# EAGLE schematic LibraryTest (EAGLE 9.2.0)
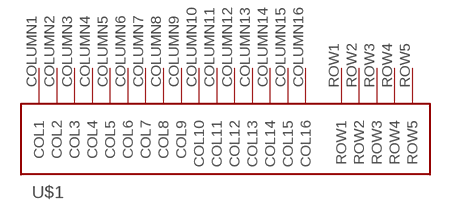
[diagram p0: schematic, sheet 1]

## Parts
U$1  SILICONEKEYBOARD  [K-1_TEST]
Unconnected: U$1.COLUMN1(COL1) U$1.COLUMN2(COL2) U$1.COLUMN3(COL3) U$1.COLUMN4(COL4) U$1.COLUMN5(COL5) U$1.COLUMN6(COL6) U$1.COLUMN7(COL7) U$1.COLUMN8(COL8) U$1.COLUMN9(COL9) U$1.COLUMN10(COL10) U$1.COLUMN11(COL11) U$1.COLUMN12(COL12) U$1.COLUMN13(COL13) U$1.COLUMN14(COL14) U$1.COLUMN15(COL15) U$1.COLUMN16(COL16) U$1.ROW1 U$1.ROW2 U$1.ROW3 U$1.ROW4 U$1.ROW5

## Library data of the parts
U$1 = SiliconeSwitches:SILICONEKEYBOARD